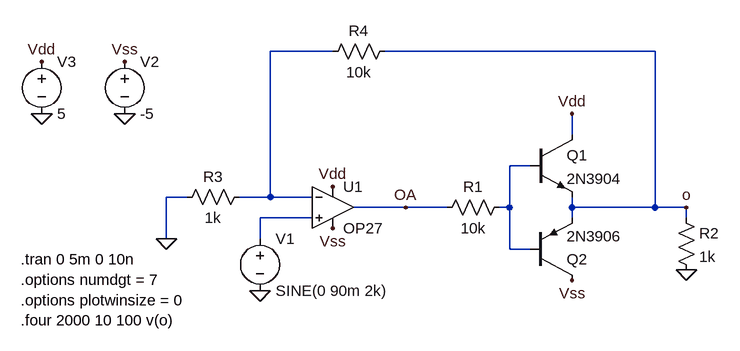
[diagram p0: schematic fig2-5.asc]
fig2-5.asc, the LTspice schematic file:
Version 4
SHEET 1 1400 680
WIRE 240 0 144 0
WIRE 736 0 320 0
WIRE 608 128 608 96
WIRE 544 176 512 176
WIRE 16 224 -16 224
WIRE 144 224 144 0
WIRE 144 224 96 224
WIRE 208 224 144 224
WIRE 352 240 272 240
WIRE 416 240 352 240
WIRE 512 240 512 176
WIRE 512 240 496 240
WIRE 608 240 608 224
WIRE 736 240 736 0
WIRE 736 240 608 240
WIRE 784 240 736 240
WIRE 208 256 128 256
WIRE 608 256 608 240
WIRE 784 256 784 240
WIRE -16 288 -16 224
WIRE 128 288 128 256
WIRE 512 304 512 240
WIRE 544 304 512 304
FLAG 128 368 0
FLAG -80 96 0
FLAG -208 96 0
FLAG -208 16 Vdd
FLAG -80 16 Vss
FLAG 608 96 Vdd
FLAG 608 352 Vss
FLAG 784 336 0
FLAG 784 240 o
FLAG 240 208 Vdd
FLAG 240 272 Vss
FLAG 352 240 OA
FLAG -16 288 0
SYMBOL voltage 128 272 R0
WINDOW 123 0 0 Left 0
WINDOW 39 0 0 Left 0
SYMATTR InstName V1
SYMATTR Value SINE(0 90m 2k)
SYMBOL voltage -80 0 R0
WINDOW 123 0 0 Left 0
WINDOW 39 0 0 Left 0
SYMATTR InstName V2
SYMATTR Value -5
SYMBOL npn 544 128 R0
SYMATTR InstName Q1
SYMATTR Value 2N3904
SYMBOL voltage -208 0 R0
WINDOW 123 0 0 Left 0
WINDOW 39 0 0 Left 0
SYMATTR InstName V3
SYMATTR Value 5
SYMBOL pnp 544 352 M180
SYMATTR InstName Q2
SYMATTR Value 2N3906
SYMBOL res 512 224 R90
WINDOW 0 0 56 VBottom 2
WINDOW 3 32 56 VTop 2
SYMATTR InstName R1
SYMATTR Value 10k
SYMBOL res 768 240 R0
SYMATTR InstName R2
SYMATTR Value 1k
SYMBOL OpAmps\\OP27 240 176 R0
SYMATTR InstName U1
SYMBOL res 112 208 R90
WINDOW 0 0 56 VBottom 2
WINDOW 3 32 56 VTop 2
SYMATTR InstName R3
SYMATTR Value 1k
SYMBOL res 336 -16 R90
WINDOW 0 0 56 VBottom 2
WINDOW 3 32 56 VTop 2
SYMATTR InstName R4
SYMATTR Value 10k
TEXT -240 320 Left 2 !.tran 0 5m 0 10n\n.options numdgt = 7\n.options plotwinsize = 0\n.four 2000 10 100 v(o)

The netlist it stands for:
* fig2-5.asc
V1 N003 0 SINE(0 90m 2k)
V2 Vss 0 -5
Q1 Vdd N002 o 0 2N3904
V3 Vdd 0 5
Q2 Vss N002 o 0 2N3906
R1 N002 OA 10k
R2 o 0 1k
XU1 N003 N001 Vdd Vss OA OP27  ; pins In+ In- V+ V- OUT
R3 N001 0 1k
R4 o N001 10k
.model NPN NPN
.model PNP PNP
.lib standard.bjt
.tran 0 5m 0 10n
.options numdgt = 7
.options plotwinsize = 0
.four 2000 10 100 v(o)
.lib ADI.lib
.backanno
.end